# EAGLE design OttoPi05b (EAGLE 9.6.2)
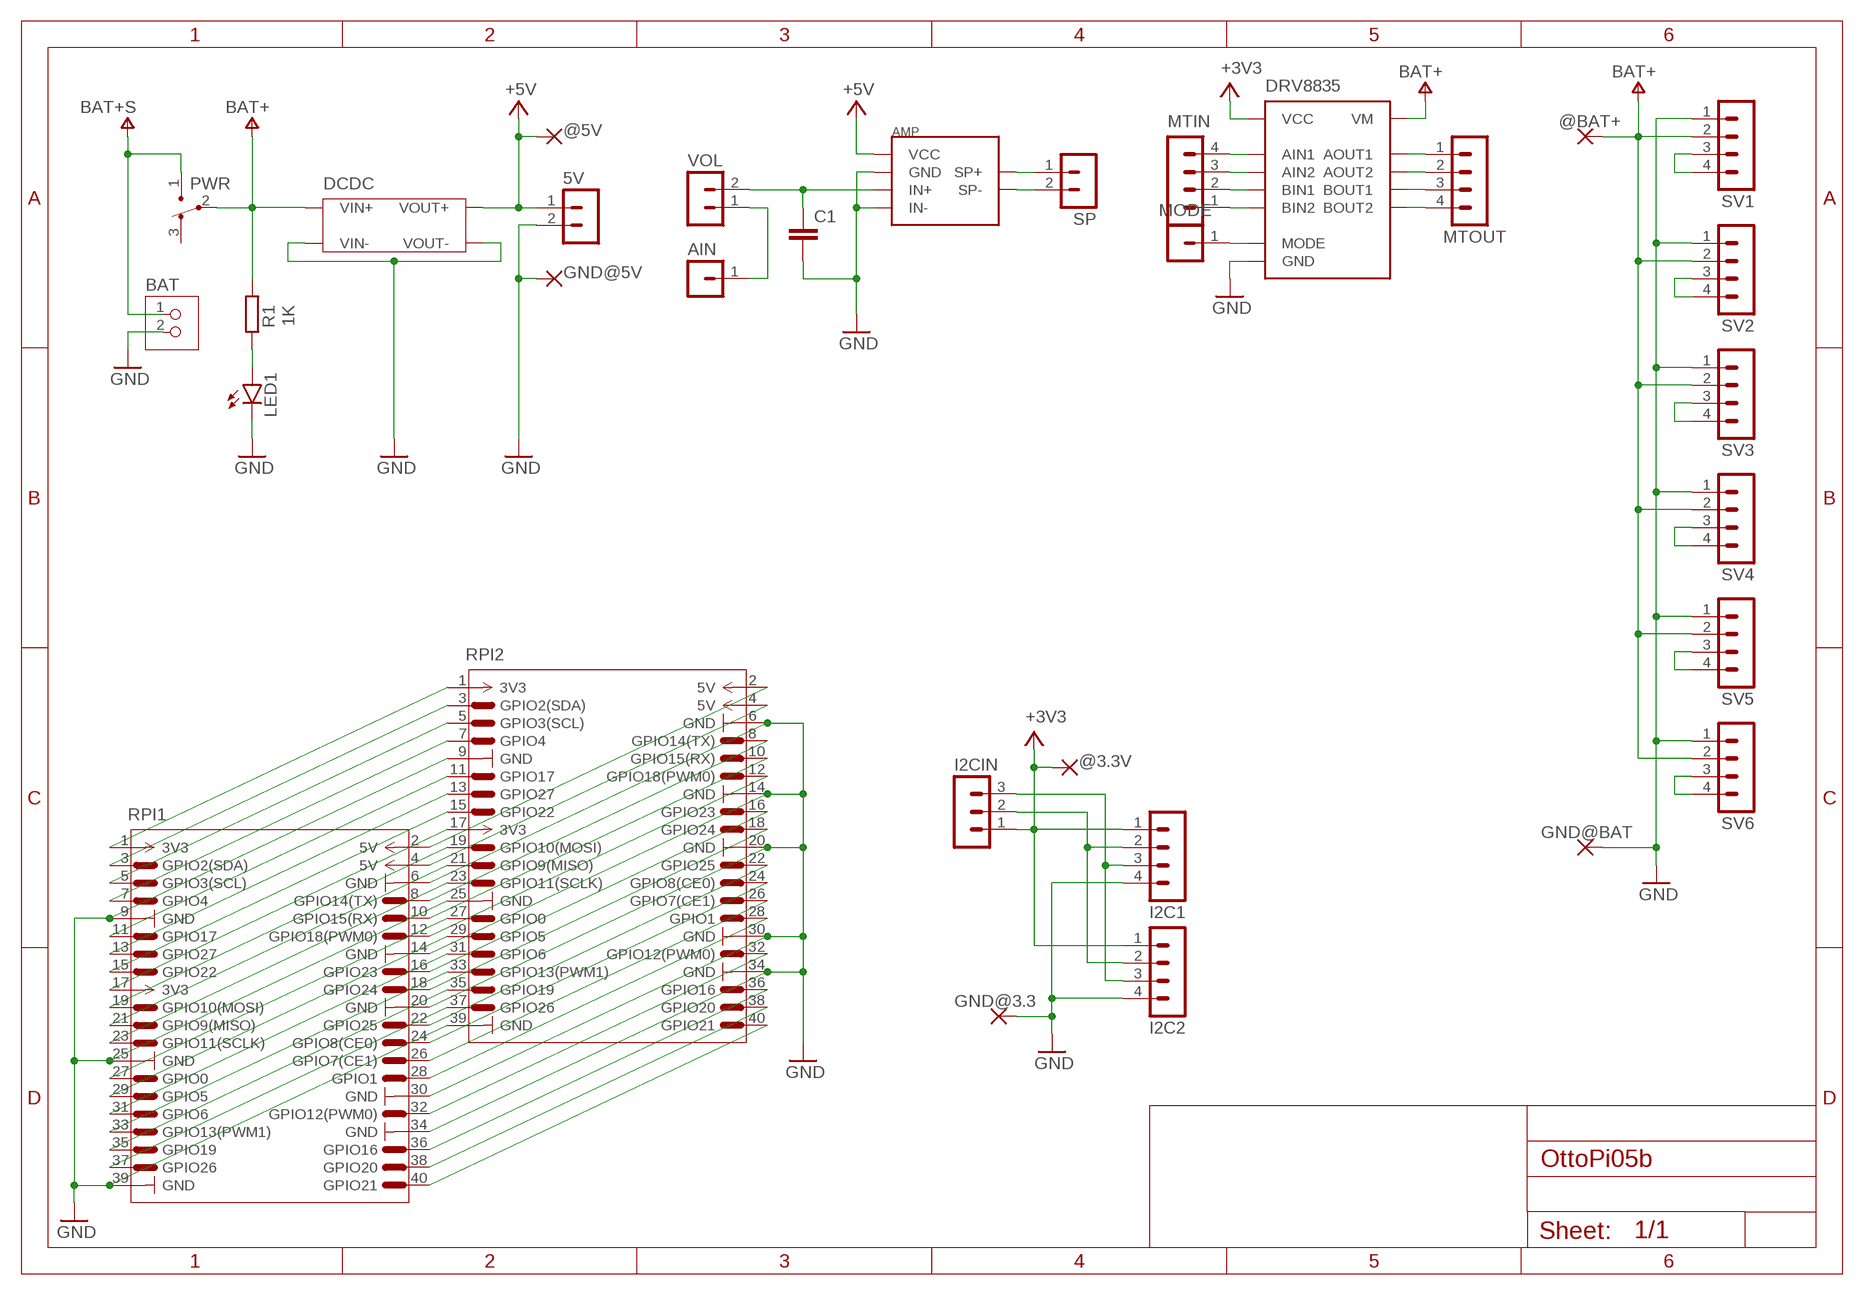
[diagram p0: schematic, sheet 1]

## Parts
5V  MA02-1  [MA02-1]
@3.3V  2,15/1,0  [2,15/1,0]
@5V  2,15/1,0  [2,15/1,0]
@BAT+  2,15/1,0  [2,15/1,0]
AIN  MA01-1  [MA01-1]
AMP  PAM8012MOD  [PAM8012MOD-A]
BAT  JST-PH2  [JST-PH2]
C1  C-EU025-024X044  [C025-024X044]
DCDC  DCDC-5V_28V-2A  [DCDC-5V_28V-2A]
DRV8835  DRV8835MOD  [DRV8835MOD]
GND@3.3  2,15/1,0  [2,15/1,0]
GND@5V  2,15/1,0  [2,15/1,0]
GND@BAT  2,15/1,0  [2,15/1,0]
I2C1  MA04-1  [MA04-1]
I2C2  MA04-1  [MA04-1]
I2CIN  MA03-1  [MA03-1]
LED1  LED3MM  [LED3MM]
MODE  MA01-1  [MA01-1]
MTIN  MA04-1  [MA04-1]
MTOUT  MA04-1  [MA04-1]
PWR  SW3-1  [SW3-1]
R1  1K  R-EU_0204/7  [0204/7]
RPI1  RPI-PIN  [RPI-PIN]
RPI2  RPI-PIN  [RPI-PIN]
SP  MA02-1  [MA02-1]
SV1  MA04-1  [MA04-1]
SV2  MA04-1  [MA04-1]
SV3  MA04-1  [MA04-1]
SV4  MA04-1  [MA04-1]
SV5  MA04-1  [MA04-1]
SV6  MA04-1  [MA04-1]
VOL  MA02-1  [MA02-1]

## Nets
+3V3: @3.3V.1(P) DRV8835.VCC I2C1.1 I2C2.1 I2CIN.1
+5V: 5V.1 @5V.1(P) AMP.V+(VCC) DCDC.VOUT+
AIN: AMP.IN+ C1.1 VOL.2
AIN1: AIN.1 VOL.1
BAT+: @BAT+.1(P) DCDC.VIN+ DRV8835.VM PWR.2 R1.2 SV1.2 SV2.2 SV3.2 SV4.2 SV5.2 SV6.2
GND: 5V.2 AMP.GND AMP.IN- BAT.2 C1.2 DCDC.VIN- DCDC.VOUT- DRV8835.GND GND@3.3.1(P) GND@5V.1(P) GND@BAT.1(P) I2C1.4 I2C2.4 LED1.K(C) RPI1.6(GND) RPI1.9(GND) RPI1.14(GND) RPI1.20(GND) RPI1.25(GND) RPI1.30(GND) RPI1.34(GND) RPI1.39(GND) RPI2.6(GND) RPI2.9(GND) RPI2.14(GND) RPI2.20(GND) RPI2.25(GND) RPI2.30(GND) RPI2.34(GND) RPI2.39(GND) SV1.1 SV2.1 SV3.1 SV4.1 SV5.1 SV6.1
LED: LED1.A R1.1
N$1: SV1.3 SV1.4
N$2: SV5.3 SV5.4
N$3: SV2.3 SV2.4
N$4: SV3.3 SV3.4
N$5: SV4.3 SV4.4
N$6: RPI1.40(GPIO21) RPI2.40(GPIO21)
N$7: RPI1.38(GPIO20) RPI2.38(GPIO20)
N$8: RPI1.36(GPIO16) RPI2.36(GPIO16)
N$9: DRV8835.MODE MODE.1
N$10: RPI1.32(GPIO12(PWM0)) RPI2.32(GPIO12(PWM0))
N$11: DRV8835.BIN2 MTIN.1
N$12: RPI1.28(GPIO1) RPI2.28(GPIO1)
N$13: RPI1.26(GPIO7(CE1)) RPI2.26(GPIO7(CE1))
N$14: RPI1.24(GPIO8(CE0)) RPI2.24(GPIO8(CE0))
N$15: RPI1.22(GPIO25) RPI2.22(GPIO25)
N$16: RPI1.2(5V) RPI2.2(5V)
N$17: RPI1.4(5V) RPI2.4(5V)
N$18: DRV8835.BIN1 MTIN.2
N$19: RPI1.8(GPIO14(TX)) RPI2.8(GPIO14(TX))
N$20: RPI1.10(GPIO15(RX)) RPI2.10(GPIO15(RX))
N$21: RPI1.12(GPIO18(PWM0)) RPI2.12(GPIO18(PWM0))
N$22: RPI1.16(GPIO23) RPI2.16(GPIO23)
N$23: RPI1.18(GPIO24) RPI2.18(GPIO24)
N$24: DRV8835.AIN2 MTIN.3
N$25: DRV8835.AIN1 MTIN.4
N$26: RPI1.1(3V3) RPI2.1(3V3)
N$27: RPI1.3(GPIO2(SDA)) RPI2.3(GPIO2(SDA))
N$28: RPI1.5(GPIO3(SCL)) RPI2.5(GPIO3(SCL))
N$29: RPI1.7(GPIO4) RPI2.7(GPIO4)
N$30: DRV8835.AOUT1 MTOUT.1
N$31: RPI1.11(GPIO17) RPI2.11(GPIO17)
N$32: RPI1.13(GPIO27) RPI2.13(GPIO27)
N$33: RPI1.15(GPIO22) RPI2.15(GPIO22)
N$34: RPI1.23(GPIO11(SCLK)) RPI2.23(GPIO11(SCLK))
N$35: RPI1.19(GPIO10(MOSI)) RPI2.19(GPIO10(MOSI))
N$36: RPI1.21(GPIO9(MISO)) RPI2.21(GPIO9(MISO))
N$37: RPI1.17(3V3) RPI2.17(3V3)
N$38: RPI1.27(GPIO0) RPI2.27(GPIO0)
N$39: RPI1.29(GPIO5) RPI2.29(GPIO5)
N$40: RPI1.31(GPIO6) RPI2.31(GPIO6)
N$41: RPI1.33(GPIO13(PWM1)) RPI2.33(GPIO13(PWM1))
N$42: RPI1.35(GPIO19) RPI2.35(GPIO19)
N$43: RPI1.37(GPIO26) RPI2.37(GPIO26)
N$44: DRV8835.AOUT2 MTOUT.2
N$45: DRV8835.BOUT1 MTOUT.3
N$46: DRV8835.BOUT2 MTOUT.4
N$47: SV6.3 SV6.4
SCL: I2C1.3 I2C2.3 I2CIN.3
SDL: I2C1.2 I2C2.2 I2CIN.2
SP+: AMP.SP+@1(SP+) SP.1
SP-: AMP.SP-@1(SP-) SP.2
V+: BAT.1 PWR.1 ; supply symbol labelled BAT+S
Unconnected: PWR.3

## Library data of the parts
5V SP VOL = ytani-con-lstb:MA02-1: PIN HEADER
@3.3V @5V @BAT+ GND@3.3 GND@5V GND@BAT = wirepad:2,15/1,0: THROUGH-HOLE PAD
AIN MODE = ytani-con-lstb:MA01-1
AMP = ytani1:PAM8012MOD: PAM8012使用2W D級アンプモジュール https://akizukidenshi.com/catalog/g/gK-08217/ Vin: 2.5V-5.5V 8ohm: 1W 4ohm: 2W IN-をGNDに接続することでシングルエンド入力としても使用できます。; CHIP1: PAM8012; OC_AKIZUKI: K-08217; URL_AKIZUKI: https://akizukidenshi.com/catalog/g/gK-08217/
BAT = ytani1:JST-PH2
C1 = rcl:C-EU: CAPACITOR, European symbol; SPICEPREFIX: C
DCDC = ytani1:DCDC-5V_28V-2A: Step-Up DC/DC converter https://www.amazon.co.jp/gp/product/B01D0WSBGY/ In 2V-24V Out 5V-28V = [VALUE] Max: 2A (1A recomended); URL_AMAZON: https://www.amazon.co.jp/gp/product/B01D0WSBGY/
DRV8835 = ytani1:DRV8835MOD: DRV8835 Motor Driver Module https://akizukidenshi.com/catalog/g/gK-09848/ Vcc = 2V-7V Vm = 0V-11V Iout = 0V-1.5A Fpwm = 0Hz-250kHz Vin = 0V-Vcc; OC_AKIZUKI: K-09848; URL_AKIZUKI: https://akizukidenshi.com/catalog/g/gK-09848/
I2C1 I2C2 MTIN MTOUT SV1-SV6 = ytani-con-lstb:MA04-1: PIN HEADER; OC_FARNELL: unknown; OC_NEWARK: unknown
I2CIN = ytani-con-lstb:MA03-1: PIN HEADER; OC_FARNELL: unknown; OC_NEWARK: unknown
LED1 = led:LED: LED OSRAM: - CHIPLED LG R971, LG N971, LY N971, LG Q971, LY Q971, LO R971, LY R971 LH N974, LH R974 LS Q976, LO Q976, LY Q976 LO Q996 - Hyper CHIPLED LW Q18S LB Q993, LB Q99A, LB R99A - SideLED LS A670, LO A670, LY A670, LG A670, LP A670 LB A673, LV A673, LT A673, LW A673 LH A674 LY A675 LS A676, LA A676, LO A676, LY A676, LW A676 LS A679, LY A679, LG A679 - Hyper Micro SIDELED® LS Y876, LA Y876, LO Y876, LY Y876 LT Y87S - SmartLED LW L88C, LW L88S LB L89C, LB L89S, LG L890 LS L89K, LO L89K, LY L89K LS L896, LA L896, LO L896, LY L896 - TOPLED LS T670, LO T670, LY T670, LG T670, LP T670 LSG T670, LSP T670, LSY T670, LOP T670, LYG T670 LG T671, LOG T671, LSG T671 LB T673, LV T673, LT T673, LW T673 LH T674 LS T676, LA T676, LO T676, LY T676, LB T676, LH T676, LSB T676, LW T676 LB T67C, LV T67C, LT T67C, LS T67K, LO T67K, LY T67K, LW E67C LS E67B, LA E67B, LO E67B, LY E67B, LB E67C, LV E67C, LT E67C LW T67C LS T679, LY T679, LG T679 LS T770, LO T770, LY T770, LG T770, LP T770 LB T773, LV T773, LT T773, LW T773 LH T774 LS E675, LA E675, LY E675, LS T675 LS T776, LA T776, LO T776, LY T776, LB T776 LHGB T686 LT T68C, LB T68C - Hyper Mini TOPLED® LB M676 - Mini TOPLED Santana® LG M470 LS M47K, LO M47K, LY M47K Source: http://www.osram.convergy.de LUXEON: - LUMILED® LXK2-PW12-R00, LXK2-PW12-S00, LXK2-PW14-U00, LXK2-PW14-V00 LXK2-PM12-R00, LXK2-PM12-S00, LXK2-PM14-U00 LXK2-PE12-Q00, LXK2-PE12-R00, LXK2-PE12-S00, LXK2-PE14-T00, LXK2-PE14-U00 LXK2-PB12-K00, LXK2-PB12-L00, LXK2-PB12-M00, LXK2-PB14-N00, LXK2-PB14-P00, LXK2-PB14-Q00 LXK2-PR12-L00, LXK2-PR12-M00, LXK2-PR14-Q00, LXK2-PR14-R00 LXK2-PD12-Q00, LXK2-PD12-R00, LXK2-PD12-S00 LXK2-PH12-R00, LXK2-PH12-S00 LXK2-PL12-P00, LXK2-PL12-Q00, LXK2-PL12-R00 Source: www.luxeon.com KINGBRIGHT: KA-3528ASYC Source: www.kingbright.com
PWR = ytani1:SW3-1: Slide Switch 3x1 pin https://www.amazon.co.jp/gp/product/B01LYVYQNO/ SS12D00G3 2ポジションSPDT 1P2T 3ピン; MF: HiLetgo; URL_AMAZON: https://www.amazon.co.jp/gp/product/B01LYVYQNO/
R1 = rcl:R-EU_: RESISTOR, European symbol; SPICEPREFIX: R
RPI1 RPI2 = ytani1:RPI-PIN

## Net classes
0 default: clearance 0.254 mm

## Board
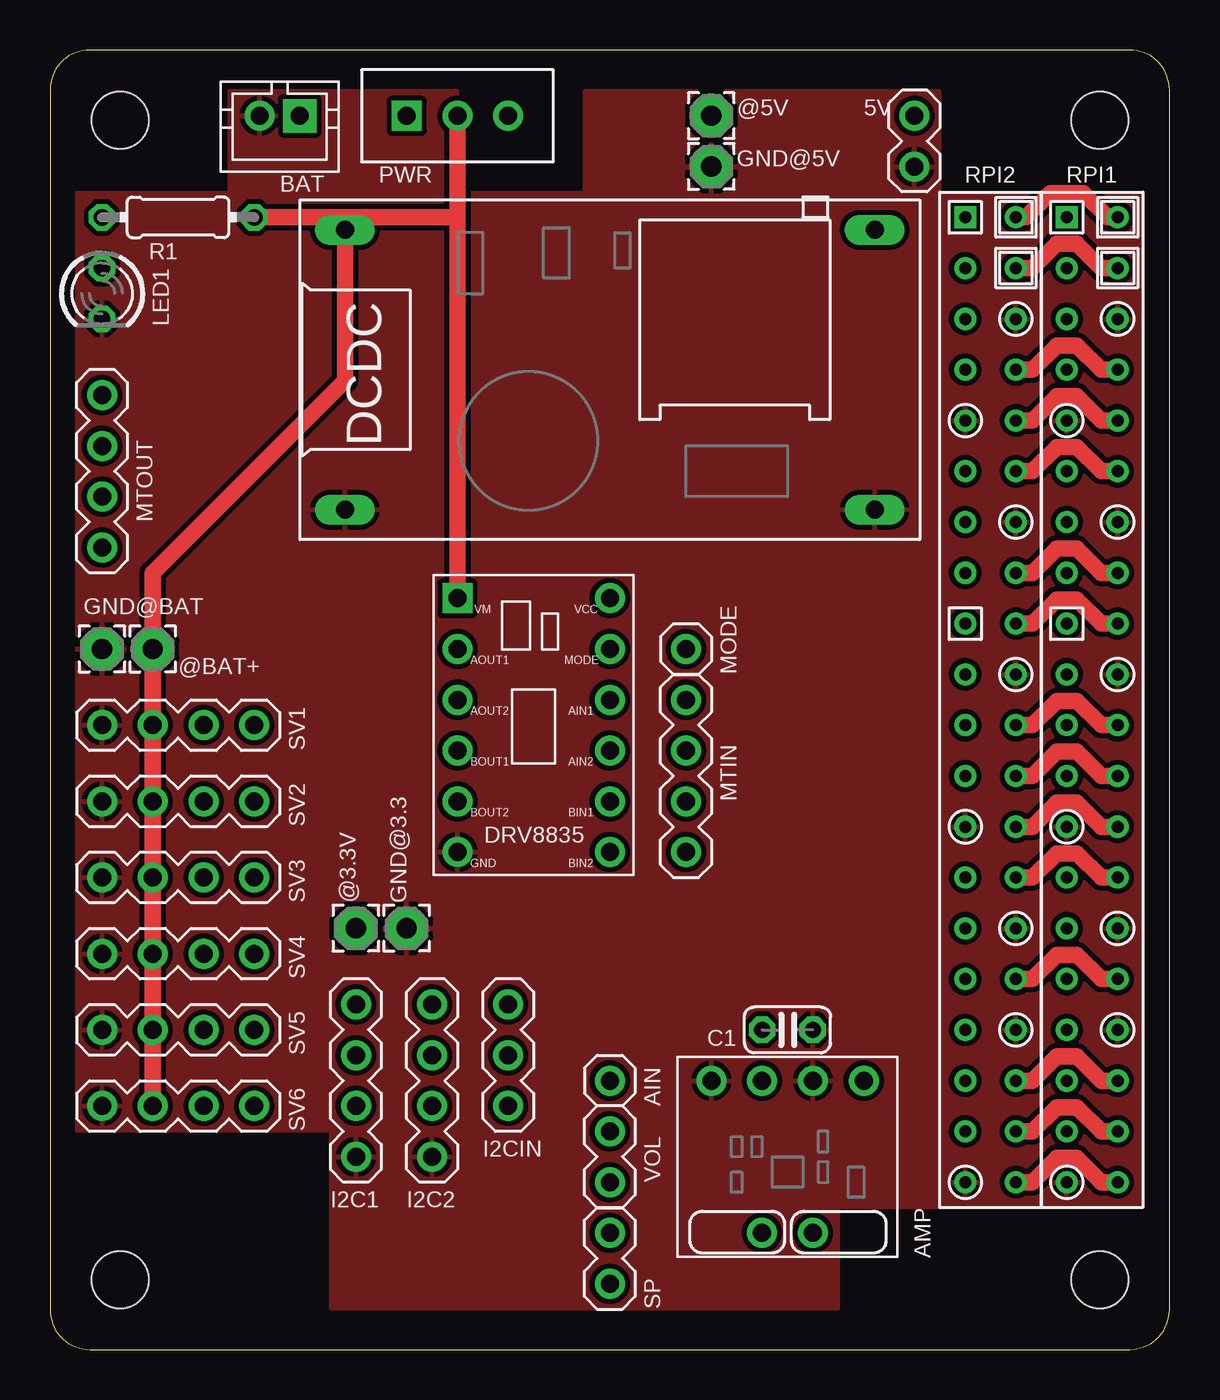
[diagram p1: board, top side]
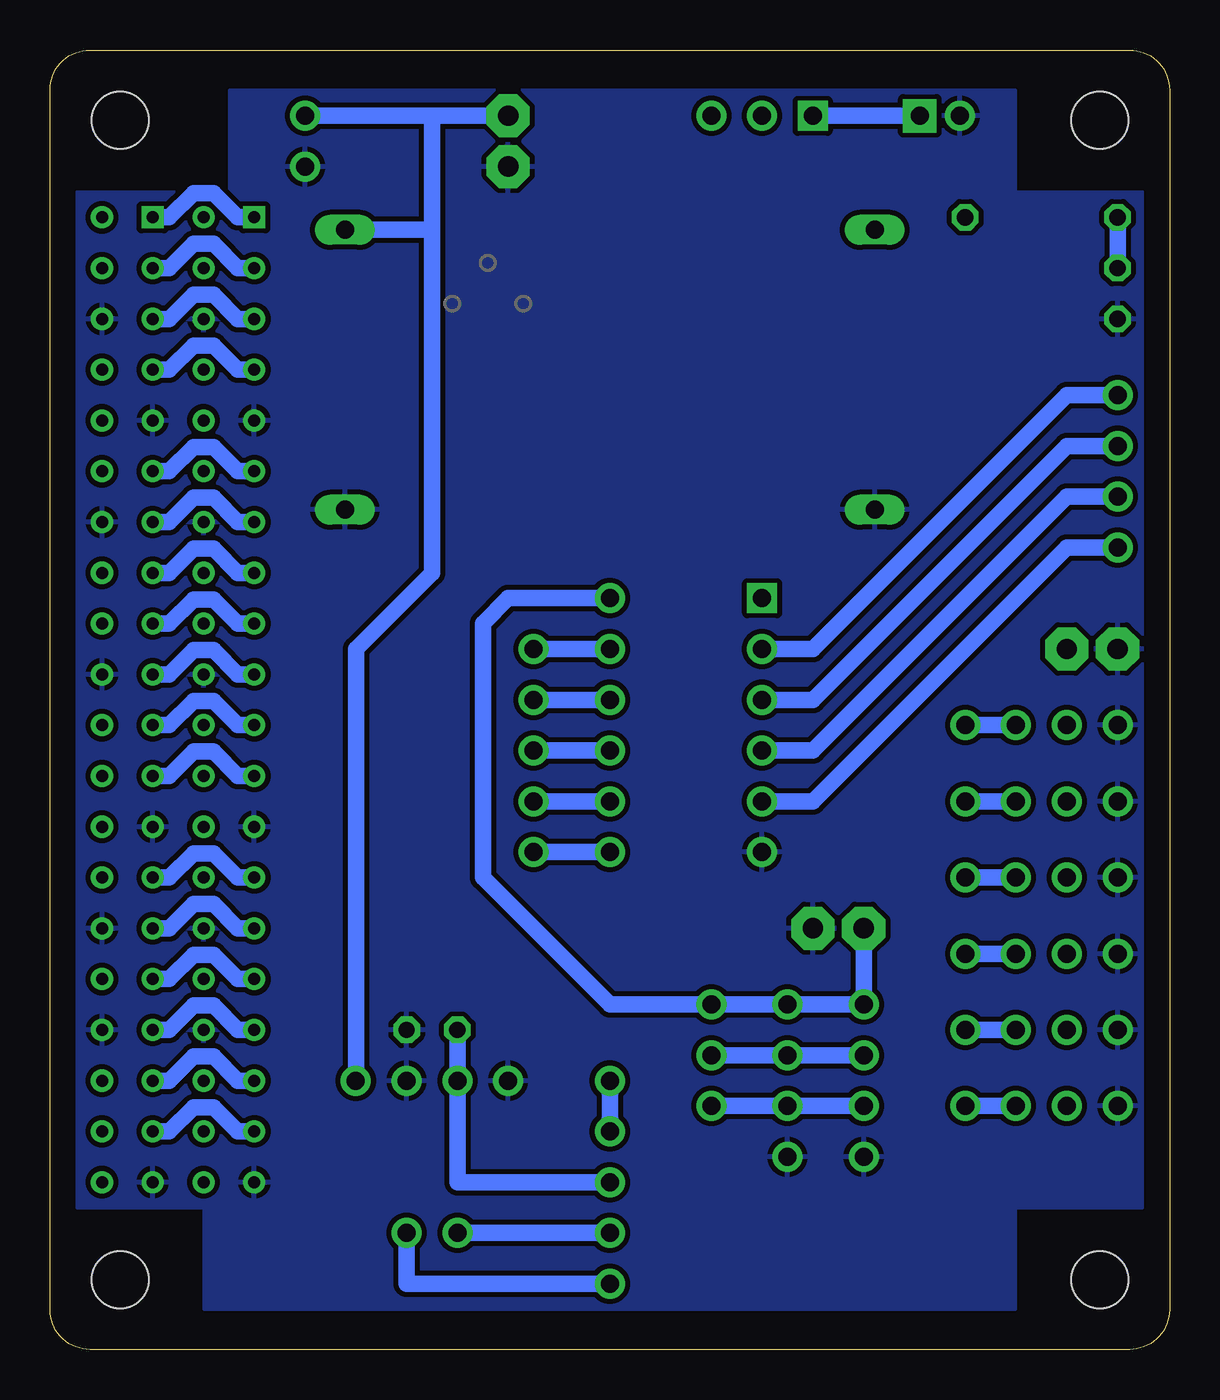
[diagram p2: board, bottom side, seen from below]

Size 56 x 65 mm. Coordinates in mm from the lower left corner, seen from the top.
Outline: 0,63 0,2 arc90 2,0 54,0 arc90 56,2 56,63 arc90 54,65 2,65 arc90 0,63
Copper layers (1*16): Top 0.035mm / dielectric 1.5mm / Bottom 0.035mm
Design rules "SeeedStudio_2layer_DRU_no_angle_20140221": minimum track width 6mil, minimum drill 12mil, track to track 6mil, track to pad 6mil, pad to pad 6mil, via to via 6mil, smd to smd 0mil, copper to edge 10mil, drill to drill 10mil, minimum pad ring 10mil, minimum via ring 6mil, stop-mask expansion 2mil, vias tented up to drill 100mil, thermal gap 10mil
Holes 2.85 mm at 3.5,3.5 52.5,3.5 52.5,61.5 3.5,61.5

### Footprints (pad centres in the part's own frame; a part is rotated, then mirrored left to right if it is on the bottom)
MA02-1 = drill 0.9 pad 1.5: 1 -1.27,0; 2 1.27,0
2,15/1,0 = drill 1.016 pad 2.159 octagon: 1 0,0
MA01-1 = drill 0.9 pad 1.5: 1 1.27,0
PAM8012MOD-A = drill 0.9 pad 1.5: GND -3.81,1.27; IN+ -3.81,-1.27; IN- -3.81,-3.81; SP+@1 3.81,1.27; SP-@1 3.81,-1.27; V+ -3.81,3.81
JST-PH2 = drill 0.9 pad 1.676 square: 1 -1,0 | drill 0.9 pad 1.5: 2 1,0
C025-024X044 = drill 0.813 octagon: 1 -1.27,0; 2 1.27,0
DCDC-5V_28V-2A = drill 0.9 pad 1.5 long: VIN+ -13.25,7; VIN- -13.25,-7; VOUT+ 13.25,7; VOUT- 13.25,-7
DRV8835MOD = drill 0.9 pad 1.5: AIN1 5.08,5.08; AIN2 5.08,2.54; AOUT1 -2.54,7.62; AOUT2 -2.54,5.08; BIN1 5.08,0; BIN2 5.08,-2.54; BOUT1 -2.54,2.54; BOUT2 -2.54,0; GND -2.54,-2.54; MODE 5.08,7.62; VCC 5.08,10.16 | drill 0.9 pad 1.5 square: VM -2.54,10.16
MA04-1 = drill 0.9 pad 1.5: 1 -3.81,0; 2 -1.27,0; 3 1.27,0; 4 3.81,0
MA03-1 = drill 0.9 pad 1.5: 1 -1.27,0; 2 1.27,0; 3 3.81,0
LED3MM = drill 0.813 octagon: A -1.27,0; K 1.27,0
SW3-1 = drill 0.9 pad 1.5 square: 1 -1.27,0 | drill 0.9 pad 1.5: 2 1.27,0; 3 3.81,0
0204/7 = drill 0.813 octagon: 1 -3.81,0; 2 3.81,0
RPI-PIN = drill 0.6 square: 1 -1.27,24.13 | drill 0.6: 2 1.27,24.13; 3 -1.27,21.59; 4 1.27,21.59; 5 -1.27,19.05; 6 1.27,19.05; 7 -1.27,16.51; 8 1.27,16.51; 9 -1.27,13.97; 10 1.27,13.97; 11 -1.27,11.43; 12 1.27,11.43; 13 -1.27,8.89; 14 1.27,8.89; 15 -1.27,6.35; 16 1.27,6.35; 17 -1.27,3.81; 18 1.27,3.81; 19 -1.27,1.27; 20 1.27,1.27; 21 -1.27,-1.27; 22 1.27,-1.27; 23 -1.27,-3.81; 24 1.27,-3.81; 25 -1.27,-6.35; 26 1.27,-6.35; 27 -1.27,-8.89; 28 1.27,-8.89; 29 -1.27,-11.43; 30 1.27,-11.43; 31 -1.27,-13.97; 32 1.27,-13.97; 33 -1.27,-16.51; 34 1.27,-16.51; 35 -1.27,-19.05; 36 1.27,-19.05; 37 -1.27,-21.59; 38 1.27,-21.59; 39 -1.27,-24.13; 40 1.27,-24.13

### Placement (x,y rotation side)
5V  43.24,60.44 270 top
@3.3V  15.3,21.07 0 top
@5V  33.08,61.71 0 top
@BAT+  5.14,35.04 0 top
AIN  26.73,13.45 0 top
AMP  36.89,9.64 270 top
BAT  11.49,61.71 180 top
C1  36.89,15.99 0 top
DCDC  28,49.01 0 top
DRV8835  22.92,27.42 0 top
GND@3.3  17.84,21.07 0 top
GND@5V  33.08,59.17 0 top
GND@BAT  2.6,35.04 0 top
I2C1  15.3,13.45 270 top
I2C2  19.11,13.45 270 top
I2CIN  22.92,15.99 270 top
LED1  2.6,52.82 270 top
MODE  30.54,35.04 0 top
MTIN  31.81,28.69 90 top
MTOUT  2.6,43.93 270 top
PWR  19.11,61.71 0 top
R1  6.41,56.63 0 top
RPI1  52.13,32.5 0 top
RPI2  47.05,32.5 0 top
SP  28,4.56 90 top
SV1  6.41,31.23 0 top
SV2  6.41,27.42 0 top
SV3  6.41,23.61 0 top
SV4  6.41,19.8 0 top
SV5  6.41,15.99 0 top
SV6  6.41,12.18 0 top
VOL  28,9.64 270 top

### Tracks (layer width: path | path; a pad name or v marks a point on that pad's centre or on a via)
+3V3
  Bottom 0.813: @3.3V.1 I2C1.1 I2C2.1 I2CIN.1 28,17.26 34.35,23.61 34.35,36.31 33.08,37.58 DRV8835.VCC
+5V
  Bottom 0.813: @5V.1 36.89,61.71 | 36.89,61.71 5V.1 | AMP.V+ 40.7,35.04 36.89,38.85 36.89,56.01 | DCDC.VOUT+ 36.89,56.01 | 36.89,61.71 36.89,56.01
AIN
  Bottom 0.813: VOL.2 35.62,8.37 AMP.IN+ C1.1
AIN1
  Bottom 0.813: AIN.1 VOL.1
BAT+
  Top 0.813: PWR.2 20.38,56.63 | 20.38,56.63 DRV8835.VM | SV6.2 SV5.2 SV4.2 SV3.2 SV2.2 SV1.2 @BAT+.1 5.14,38.85 14.75,48.46 DCDC.VIN+ 14.75,56.63 | 14.75,56.63 20.38,56.63 | R1.2 14.75,56.63
GND
  pour Bottom: 1.33,57.9 7.68,57.9 7.68,62.98 47.05,62.98 47.05,57.9 54.67,57.9 54.67,7.1 48.32,7.1 48.32,2.02 7.68,2.02 7.68,7.1 1.33,7.1
  pour Top: 8.95,57.9 8.95,62.98 20.38,62.98 20.38,57.9 26.73,57.9 26.73,62.98 44.51,62.98 44.51,57.9 54.67,57.9 54.67,7.1 39.43,7.1 39.43,2.02 14.03,2.02 14.03,10.91 1.33,10.91 1.33,57.9
LED
  Bottom 0.813: R1.1 LED1.A
N$1
  Bottom 0.813: SV1.3 SV1.4
N$2
  Bottom 0.813: SV5.3 SV5.4
N$3
  Bottom 0.813: SV2.3 SV2.4
N$4
  Bottom 0.813: SV3.3 SV3.4
N$5
  Bottom 0.813: SV4.3 SV4.4
N$6
  Top 0.813: RPI2.40 49.14,8.37 50.36,9.58 51.36,9.58 52.58,8.37 RPI1.40
N$7
  Top 0.813: RPI2.38 49.14,10.91 50.36,12.12 51.36,12.12 52.58,10.91 RPI1.38
N$8
  Top 0.813: RPI2.36 49.14,13.45 50.36,14.66 51.36,14.66 52.58,13.45 RPI1.36
N$9
  Bottom 0.813: MODE.1 DRV8835.MODE
N$10
  Top 0.813: RPI2.32 49.14,18.53 50.36,19.74 51.36,19.74 52.58,18.53 RPI1.32
N$11
  Bottom 0.813: MTIN.1 DRV8835.BIN2
N$12
  Top 0.813: RPI2.28 49.14,23.61 50.36,24.82 51.36,24.82 52.58,23.61 RPI1.28
N$13
  Top 0.813: RPI2.26 49.14,26.15 50.36,27.36 51.36,27.36 52.58,26.15 RPI1.26
N$14
  Top 0.813: RPI2.24 49.14,28.69 50.36,29.9 51.36,29.9 52.58,28.69 RPI1.24
N$15
  Top 0.813: RPI2.22 49.14,31.23 50.36,32.44 51.36,32.44 52.58,31.23 RPI1.22
N$16
  Top 0.813: RPI2.2 48.82,56.63 50.03,57.84 51.69,57.84 52.9,56.63 RPI1.2
N$17
  Top 0.813: RPI2.4 49.14,54.09 50.36,55.3 51.36,55.3 52.58,54.09 RPI1.4
N$18
  Bottom 0.813: MTIN.2 DRV8835.BIN1
N$19
  Top 0.813: RPI2.8 49.14,49.01 50.36,50.22 51.36,50.22 52.58,49.01 RPI1.8
N$20
  Top 0.813: RPI2.10 49.14,46.47 50.36,47.68 51.36,47.68 52.58,46.47 RPI1.10
N$21
  Top 0.813: RPI2.12 49.14,43.93 50.36,45.14 51.36,45.14 52.58,43.93 RPI1.12
N$22
  Top 0.813: RPI2.16 49.14,38.85 50.36,40.06 51.36,40.06 52.58,38.85 RPI1.16
N$23
  Top 0.813: RPI2.18 49.14,36.31 50.36,37.52 51.36,37.52 52.58,36.31 RPI1.18
N$24
  Bottom 0.813: MTIN.3 DRV8835.AIN2
N$25
  Bottom 0.813: MTIN.4 DRV8835.AIN1
N$26
  Bottom 0.813: RPI2.1 46.6,56.63 47.82,57.84 48.82,57.84 50.04,56.63 RPI1.1
N$27
  Bottom 0.813: RPI2.3 46.6,54.09 47.82,55.3 48.82,55.3 50.04,54.09 RPI1.3
N$28
  Bottom 0.813: RPI2.5 46.6,51.55 47.82,52.76 48.82,52.76 50.04,51.55 RPI1.5
N$29
  Bottom 0.813: RPI2.7 46.6,49.01 47.82,50.22 48.82,50.22 50.04,49.01 RPI1.7
N$30
  Bottom 0.813: MTOUT.1 5.14,47.74 17.84,35.04 DRV8835.AOUT1
N$31
  Bottom 0.813: RPI2.11 46.6,43.93 47.82,45.14 48.82,45.14 50.04,43.93 RPI1.11
N$32
  Bottom 0.813: RPI2.13 46.6,41.39 47.82,42.6 48.82,42.6 50.04,41.39 RPI1.13
N$33
  Bottom 0.813: RPI2.15 46.6,38.85 47.82,40.06 48.82,40.06 50.04,38.85 RPI1.15
N$34
  Bottom 0.813: RPI2.23 46.6,28.69 47.82,29.9 48.82,29.9 50.04,28.69 RPI1.23
N$35
  Bottom 0.813: RPI2.19 46.6,33.77 47.82,34.98 48.82,34.98 50.04,33.77 RPI1.19
N$36
  Bottom 0.813: RPI2.21 46.6,31.23 47.82,32.44 48.82,32.44 50.04,31.23 RPI1.21
N$37
  Bottom 0.813: RPI2.17 46.6,36.31 47.82,37.52 48.82,37.52 50.04,36.31 RPI1.17
N$38
  Bottom 0.813: RPI2.27 46.6,23.61 47.82,24.82 48.82,24.82 50.04,23.61 RPI1.27
N$39
  Bottom 0.813: RPI2.29 46.6,21.07 47.82,22.28 48.82,22.28 50.04,21.07 RPI1.29
N$40
  Bottom 0.813: RPI2.31 46.6,18.53 47.82,19.74 48.82,19.74 50.04,18.53 RPI1.31
N$41
  Bottom 0.813: RPI2.33 46.6,15.99 47.82,17.2 48.82,17.2 50.04,15.99 RPI1.33
N$42
  Bottom 0.813: RPI2.35 46.6,13.45 47.82,14.66 48.82,14.66 50.04,13.45 RPI1.35
N$43
  Bottom 0.813: RPI2.37 46.6,10.91 47.82,12.12 48.82,12.12 50.04,10.91 RPI1.37
N$44
  Bottom 0.813: MTOUT.2 5.14,45.2 17.84,32.5 DRV8835.AOUT2
N$45
  Bottom 0.813: MTOUT.3 5.14,42.66 17.84,29.96 DRV8835.BOUT1
N$46
  Bottom 0.813: MTOUT.4 5.14,40.12 17.84,27.42 DRV8835.BOUT2
N$47
  Bottom 0.813: SV6.3 SV6.4
SCL
  Bottom 0.813: I2C1.3 I2C2.3 I2CIN.3
SDL
  Bottom 0.813: I2C1.2 I2C2.2 I2CIN.2
SP+
  Bottom 0.813: AMP.SP+@1 38.16,3.29 SP.1
SP-
  Bottom 0.813: AMP.SP-@1 SP.2
V+
  Bottom 0.813: PWR.1 BAT.1